# EAGLE design DualPhotodiode (EAGLE 5.11)
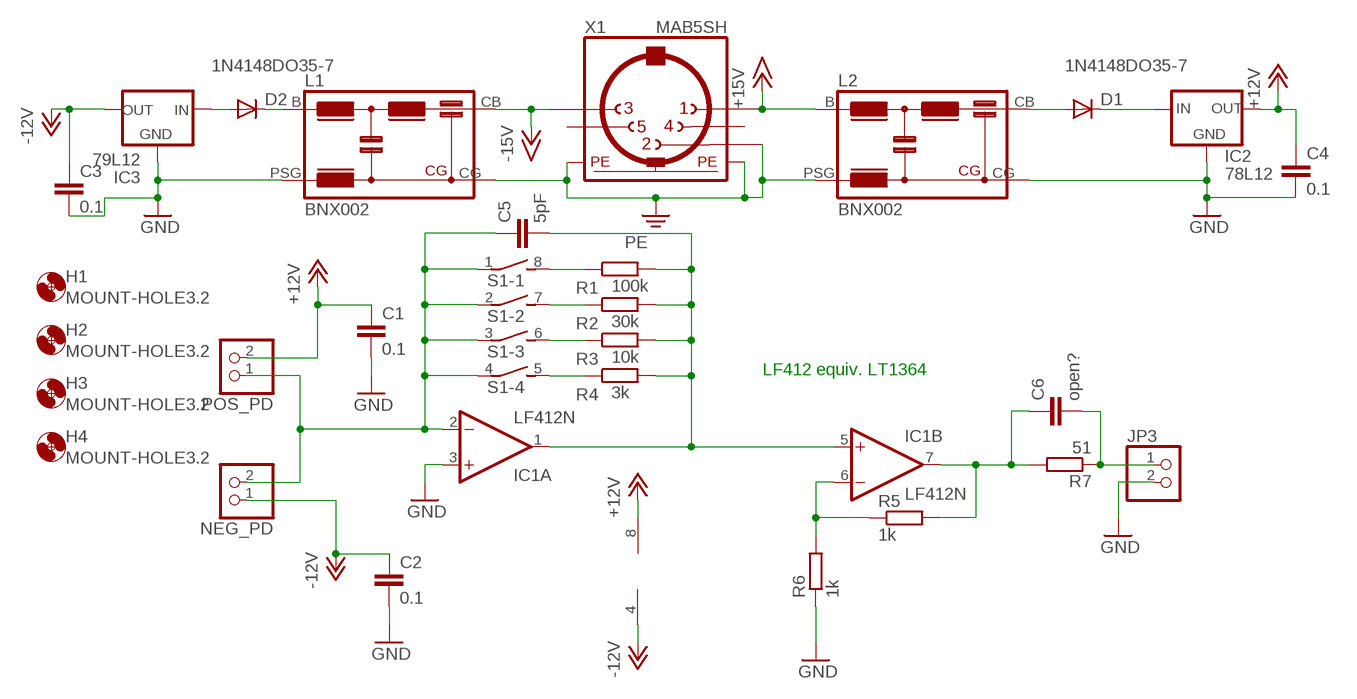
[diagram p0: schematic, sheet 1]

## Parts
C1  0.1  C-EU025-025X050  [C025-025X050]
C2  0.1  C-EU025-025X050  [C025-025X050]
C3  0.1  C-EU025-025X050  [C025-025X050]
C4  0.1  C-EU025-025X050  [C025-025X050]
C5  5pF  C-EU025-025X050  [C025-025X050]
C6  open?  C-EU025-025X050  [C025-025X050]
D1  1N4148DO35-7  [DO35-7]
D2  1N4148DO35-7  [DO35-7]
H1  MOUNT-HOLE3.2  [3,2]
H2  MOUNT-HOLE3.2  [3,2]
H3  MOUNT-HOLE3.2  [3,2]
H4  MOUNT-HOLE3.2  [3,2]
IC1  LF412N  [DIL08]
IC2  78L12  78LXX  [78LXX]
IC3  79L12  79LXX  [79LXX]
JP3  PINHD-1X2  [1X02]
L1  BNX002  [BNX002]
L2  BNX002  [BNX002]
NEG_PD  PINHD-1X2  [1X02]
POS_PD  PINHD-1X2  [1X02]
R1  100k  R-EU_0204/7  [0204/7]
R2  30k  R-EU_0204/7  [0204/7]
R3  10k  R-EU_0204/7  [0204/7]
R4  3k  R-EU_0204/7  [0204/7]
R5  1k  R-EU_0204/7  [0204/7]
R6  1k  R-EU_0204/7  [0204/7]
R7  51  R-EU_0204/7  [0204/7]
S1  DIP04S  [DIP04S]
X1  MAB5SH  [MAB5SH]

## Nets
+12V: C1.1 C4.1 IC1.8(P:V+) IC2.OUT POS_PD.2
+15V: L2.B X1.1
-12V: C2.1 C3.1 IC1.4(P:V-) IC3.OUT NEG_PD.1
-15V: L1.CB X1.3
GND: C1.2 C2.2 C3.2 C4.2 IC1.3(A:+IN) IC2.GND IC3.GND JP3.2 L1.PSG L2.CG R6.1
N$5: D1.A L2.CB
N$6: D1.C IC2.IN
N$7: D2.A IC3.IN
N$8: D2.C L1.B
N$10: C5.1 IC1.2(A:-IN) NEG_PD.2 POS_PD.1 S1.1 S1.2 S1.3 S1.4
N$11: C5.2 IC1.1(A:OUT) IC1.5(B:+IN) R1.2 R2.2 R3.2 R4.2
N$12: IC1.6(B:-IN) R5.1 R6.2
N$13: C6.1 IC1.7(B:OUT) R5.2 R7.2
N$14: R1.1 S1.8
N$15: R2.1 S1.7
N$16: R3.1 S1.6
N$17: R4.1 S1.5
N$18: C6.2 JP3.1 R7.1
PE: L1.CG L2.PSG X1.2 X1.PE X1.PE@(PE)
Unconnected: X1.4 X1.5

## Notes on the sheet
- LF412 equiv. LT1364

## Library data of the parts
C1-C6 = rcl:C-EU: CAPACITOR, European symbol
D1 D2 = diode:1N4148: DIODE high speed (Philips)
H1-H4 = holes:MOUNT-HOLE: MOUNTING HOLE with drill center marker
IC1 = linear:LF412: OP AMP
IC2 = v-reg:78LXX: VOLTAGE REGULATOR
IC3 = v-reg:79LXX: VOLTAGE REGULATOR
JP3 NEG_PD POS_PD = pinhead:PINHD-1X2: PIN HEADER
L1 L2 = inductors:BNX002: FILTER
R1-R7 = rcl:R-EU_: RESISTOR, European symbol
S1 = switch-dil:DIP04S: DIL/CODE SWITCH; OC_FARNELL: unknown; OC_NEWARK: unknown
X1 = con-hirschmann:MAB5SH: Female CONNECTOR 5 pins 90 deg. with shield, horizontal (DIN 41524); OC_FARNELL: 809883; OC_NEWARK: unknown

## Board
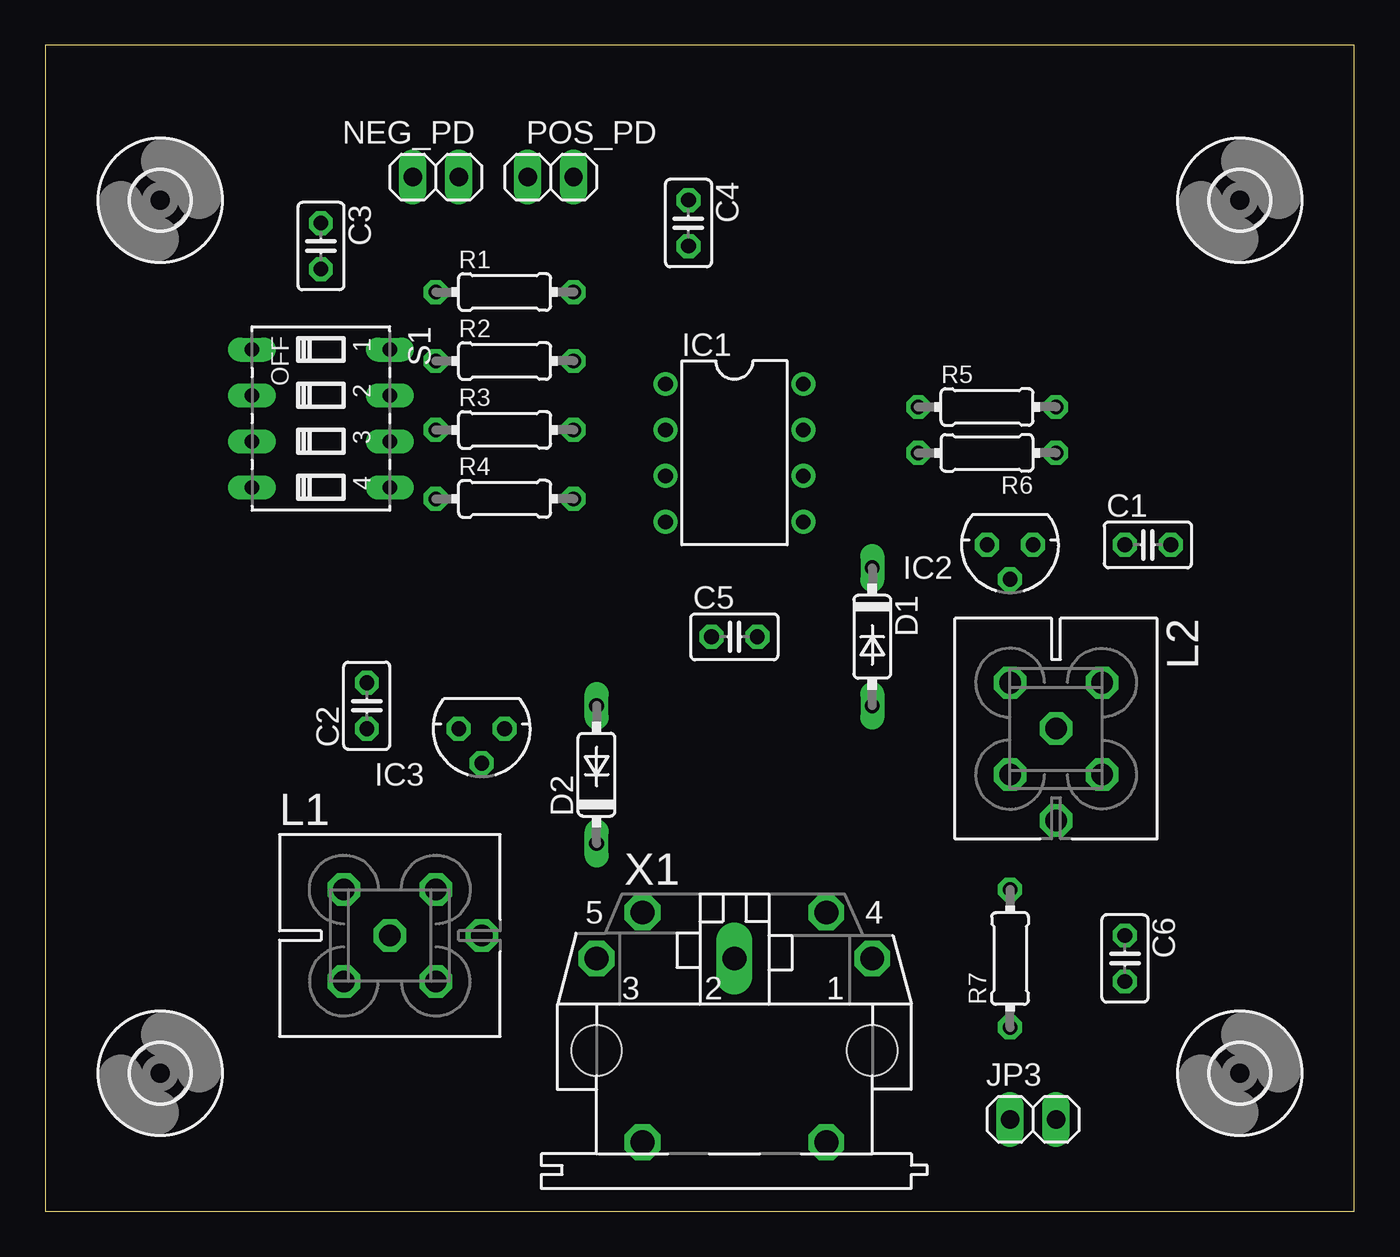
[diagram p1: board, top side]
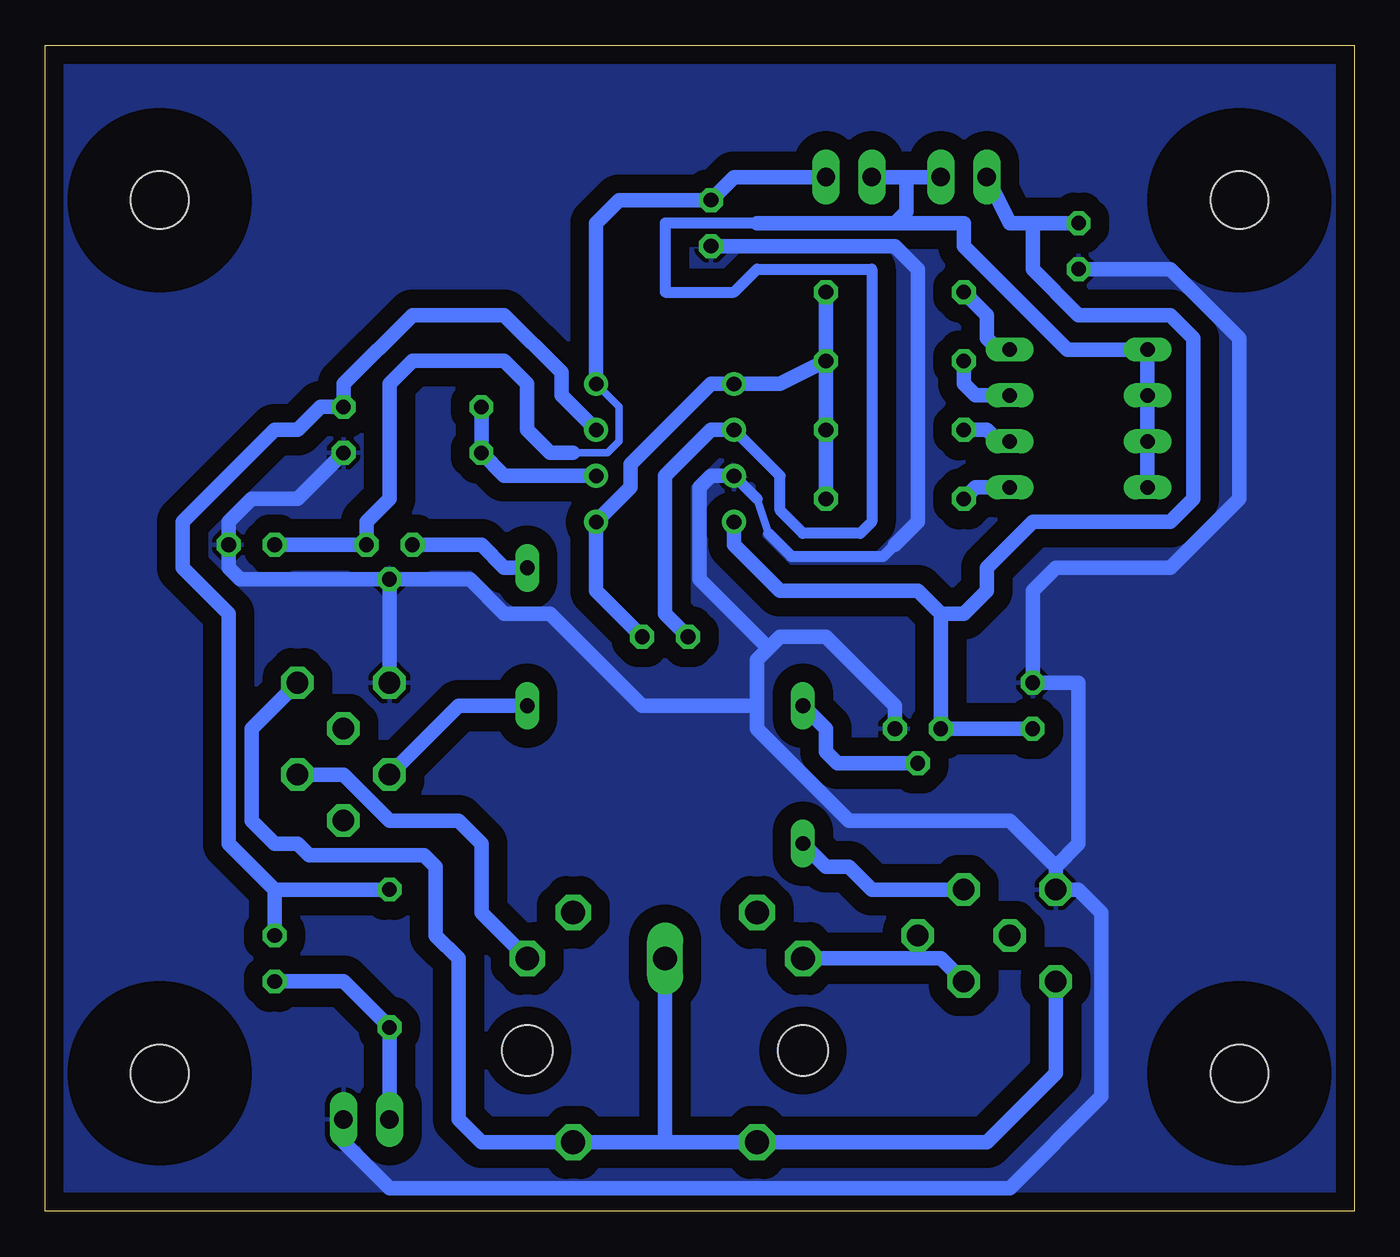
[diagram p2: board, bottom side, seen from below]

Size 72.37 x 64.44 mm. Coordinates in mm from the lower left corner, seen from the top.
Outline: 0,0 72.37,0 72.37,64.44 0,64.44 0,0
Copper layers (1*16): Top 0.035mm / dielectric 1.5mm / Bottom 0.035mm
Design rules "default": minimum track width 10mil, minimum drill 24mil, track to track 8mil, track to pad 8mil, pad to pad 8mil, via to via 8mil, smd to smd 8mil, copper to edge 40mil, drill to drill 8mil, minimum pad ring 10mil, minimum via ring 8mil, stop-mask expansion 4mil, vias tented up to drill 0mil, thermal gap 10mil

### Footprints (pad centres in the part's own frame; a part is rotated, then mirrored left to right if it is on the bottom)
C025-025X050 = drill 0.813 octagon: 1 -1.27,0; 2 1.27,0
DO35-7 = drill 0.813 long: A 3.81,0; C -3.81,0
3,2 = hole 3.2: 0,0
DIL08 = drill 0.813 pad 1.27 round: 1 -3.81,-3.81; 2 -1.27,-3.81; 3 1.27,-3.81; 4 3.81,-3.81; 5 3.81,3.81; 6 1.27,3.81; 7 -1.27,3.81; 8 -3.81,3.81
78LXX = drill 0.813 octagon: GND 0,1.905; IN 1.27,0; OUT -1.27,0
79LXX = drill 0.813 octagon: GND -1.27,0; IN 0,1.905; OUT 1.27,0
1X02 = drill 1.016 long: 1 -1.27,0; 2 1.27,0
BNX002 = drill 1.194 octagon: B 2.54,2.54; CB 2.54,-2.54; CG -2.54,-2.54; CG1 0,0; CG2 5.08,0; PSG -2.54,2.54
0204/7 = drill 0.813 octagon: 1 -3.81,0; 2 3.81,0
DIP04S = drill 0.813 long: 1 -3.81,-3.81; 2 -1.27,-3.81; 3 1.27,-3.81; 4 3.81,-3.81; 5 3.81,3.81; 6 1.27,3.81; 7 -1.27,3.81; 8 -3.81,3.81
MAB5SH = drill 1.321 octagon: 1 7.62,5.08; 3 -7.62,5.08; 4 5.08,7.62; 5 -5.08,7.62; PE -5.08,-5.08; PE@ 5.08,-5.08 | drill 1.321 long: 2 0,5.08 | hole 2.794: 7.62,0; -7.62,0

### Placement (x,y rotation side)
C1  60.96,36.83 0 top
C2  17.78,27.94 90 top
C3  15.24,53.34 270 top
C4  35.56,54.61 270 top
C5  38.1,31.75 0 top
C6  59.69,13.97 270 top
D1  45.72,31.75 270 top
D2  30.48,24.13 90 top
H1  6.35,7.62 0 top
H2  6.35,55.88 0 top
H3  66.04,55.88 0 top
H4  66.04,7.62 0 top
IC1  38.1,41.91 270 top
IC2  53.34,36.83 180 top
IC3  24.13,26.67 180 top
JP3  54.61,5.08 0 top
L1  19.05,15.24 0 top
L2  55.88,26.67 270 top
NEG_PD  21.59,57.15 0 top
POS_PD  27.94,57.15 0 top
R1  25.4,50.8 0 top
R2  25.4,46.99 0 top
R3  25.4,43.18 0 top
R4  25.4,39.37 0 top
R5  52.07,44.45 0 top
R6  52.07,41.91 180 top
R7  53.34,13.97 90 top
S1  15.24,43.81 270 top
X1  38.1,8.89 0 top

### Tracks (layer width: path | path; a pad name or v marks a point on that pad's centre or on a via)
+12V
  Bottom 0.406: 43.18,41.91 41.27,41.91 40.64,42.55 40.64,44.45 IC1.8
  Bottom 0.813: C1.1 IC2.OUT 54.61,38.1 53.34,39.37 53.34,45.72 52.07,46.99 46.99,46.99 45.72,45.72 45.72,43.18 44.45,41.91 43.18,41.91 | IC1.8 41.91,54.61 40.64,55.88 C4.1 34.29,57.15 POS_PD.2
+15V
  Bottom 0.813: X1.1 48.26,16.51 48.26,20.32 49.53,21.59 53.34,21.59 55.88,24.13 L2.B
-12V
  Bottom 0.813: 17.78,54.61 C3.1 | 17.78,54.61 19.05,54.61 NEG_PD.1 | C2.1 IC3.OUT 22.86,33.02 | IC1.4 34.29,36.83 31.75,34.29 24.13,34.29 22.86,33.02 | 17.78,54.61 17.78,52.07 15.24,49.53 10.16,49.53 8.89,48.26 8.89,39.37 10.16,38.1 17.78,38.1 20.32,35.56 20.32,34.29 21.59,33.02 22.86,33.02
-15V
  Bottom 0.813: X1.3 22.86,13.97 L1.CB
GND
  Bottom 0.406: 33.02,39.37 32.38,37.47
  Bottom 0.61: IC1.3 33.02,39.37 | 32.38,37.47 31.11,36.2 26.04,36.2 25.4,36.83
  Bottom 0.813: IC3.GND 25.4,27.94 29.21,31.75 31.75,31.75 32.38,31.11 | C3.2 10.16,52.07 6.35,48.26 6.35,39.37 10.16,35.56 16.51,35.56 17.78,34.29 C2.2 15.24,29.21 15.24,20.32 16.51,19.05 | R6.1 58.42,39.37 60.96,39.37 62.23,38.1 C1.2 62.23,35.56 61.59,34.92 IC2.GND | 16.51,19.05 L1.PSG 15.24,17.78 13.97,16.51 13.97,6.35 19.05,1.27 53.34,1.27 55.88,3.81 JP3.2 | 16.51,19.05 19.05,21.59 27.94,21.59 33.02,26.67 33.02,27.94 | 33.02,27.94 33.02,30.48 32.38,31.11 | IC1.3 35.56,40.64 36.2,40.01 36.2,34.92 32.38,31.11 | IC2.GND 48.9,34.92 46.99,33.02 44.45,33.02 39.37,27.94 33.02,27.94 | IC2.GND L2.CG | C4.2 25.4,53.34 24.13,52.07 24.13,38.1 25.4,36.83
  pour Bottom (isolate 1.016): 0,0 0,64.77 72.39,64.77 72.39,0 60.96,0
N$5
  Bottom 0.813: L2.CB 49.53,27.94 D1.A
N$6
  Bottom 0.813: D1.C 46.99,35.56 48.26,36.83 IC2.IN
N$7
  Bottom 0.813: D2.A 29.21,26.67 29.21,25.4 28.57,24.77 IC3.IN
N$8
  Bottom 0.813: L1.B 26.67,17.78 27.94,19.05 29.21,19.05 D2.C
N$10
  Bottom 0.61: 33.02,54.61 38.1,54.61 38.1,50.8 34.29,50.8 33.02,52.07 26.67,52.07 26.67,38.1 27.3,37.47 30.48,37.47 31.75,38.73 31.75,40.64 IC1.2
  Bottom 0.813: S1.4 S1.3 S1.2 S1.1 15.88,47.62 21.59,53.34 21.59,54.61 25.4,54.61 | IC1.2 35.56,43.18 38.1,40.64 38.1,33.02 C5.1 | 24.77,57.15 NEG_PD.2 | 24.77,57.15 POS_PD.1 | 25.4,54.61 33.02,54.61 | 24.77,57.15 24.77,55.24 25.4,54.61
N$11
  Bottom 0.813: C5.2 41.91,34.29 IC1.5 40.01,40.01 40.01,41.27 35.56,45.72 IC1.1 31.75,45.72 R2.2 | R2.2 R1.2 | R2.2 R3.2 R4.2
N$12
  Bottom 0.813: IC1.6 46.99,40.64 R6.2 R5.1
N$13
  Bottom 0.813: 59.69,17.78 62.23,20.32 62.23,33.02 64.77,35.56 64.77,38.1 59.69,43.18 58.42,43.18 57.15,44.45 R5.2 55.88,45.72 52.07,49.53 46.99,49.53 43.81,46.35 43.81,45.09 IC1.7 | 59.69,17.78 C6.1 | R7.2 59.69,17.78
N$14
  Bottom 0.813: S1.8 19.68,47.62 20.32,48.26 20.32,49.53 R1.1
N$15
  Bottom 0.813: S1.7 20.95,45.09 21.59,45.72 R2.1
N$16
  Bottom 0.813: S1.6 19.68,42.55 20.32,43.18 R3.1
N$17
  Bottom 0.813: S1.5 20.95,40.01 R4.1
N$18
  Bottom 0.813: C6.2 55.88,12.7 R7.1 JP3.1
PE
  Bottom 0.813: 38.1,3.81 X1.PE 20.32,3.81 16.51,7.62 L1.CG | 38.1,3.81 X1.PE@ 48.26,3.81 49.53,5.08 49.53,13.97 50.8,15.24 50.8,19.05 51.44,19.68 57.78,19.68 58.42,20.32 59.69,20.32 60.96,21.59 60.96,26.67 L2.PSG | 38.1,3.81 X1.2